# Altium schematic sheet ALIM.SchDoc
size A4
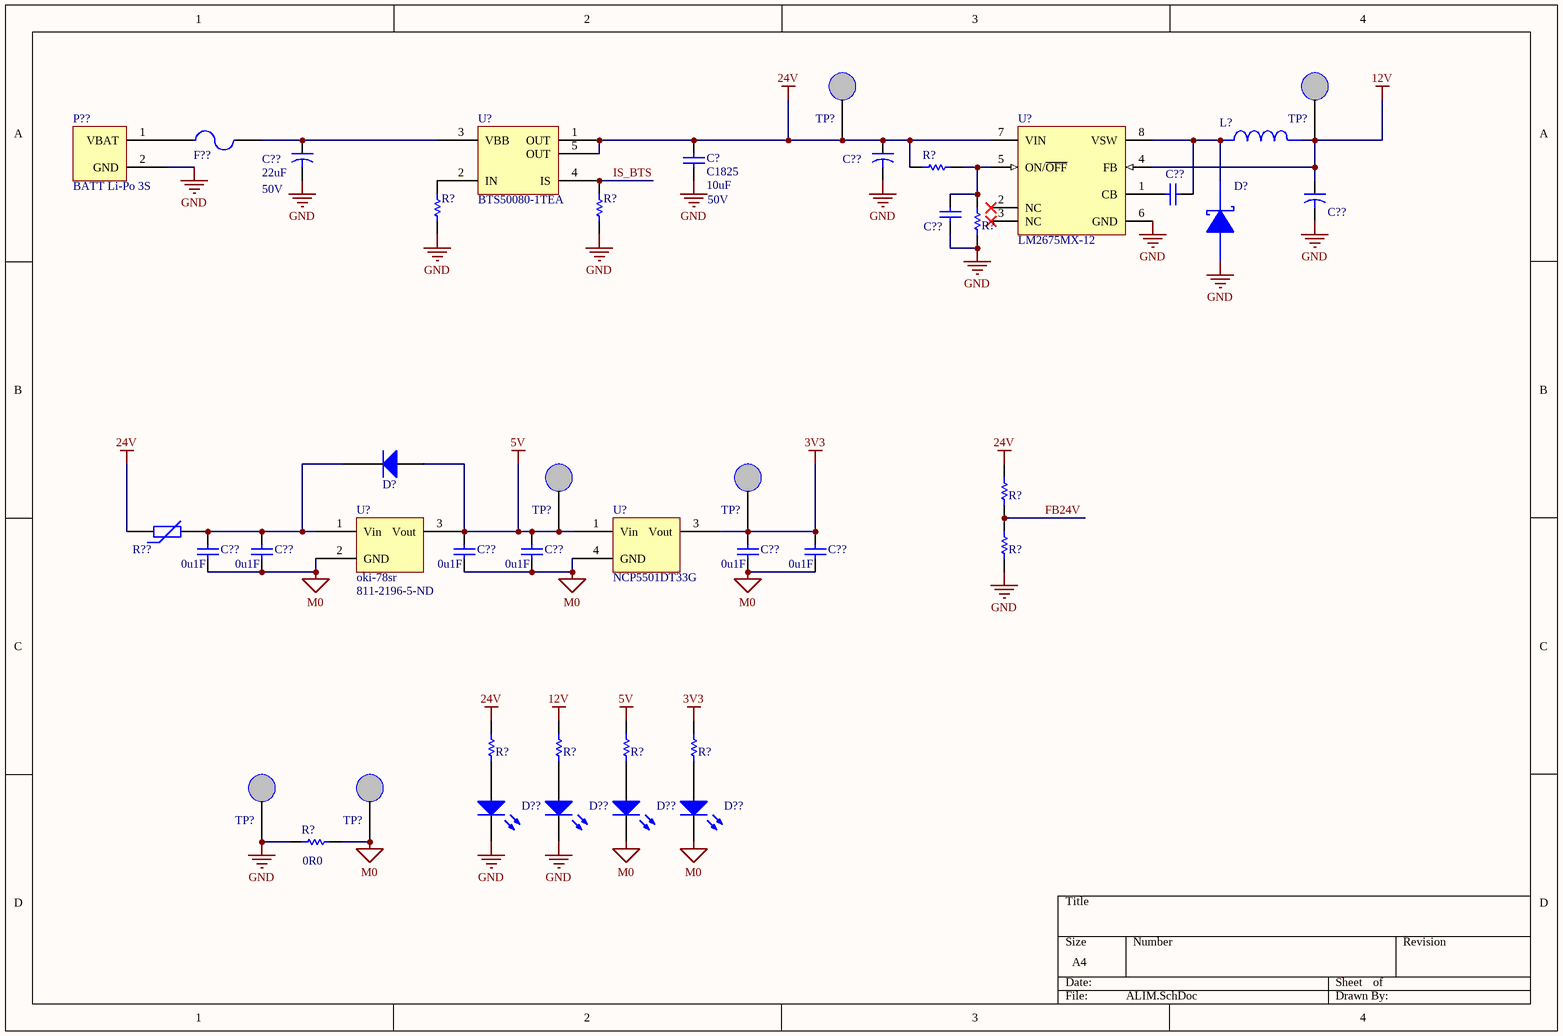
[diagram p0: ALIM.SchDoc]

## Parts
(Parts that share a designator on the sheet are numbered #1, #2 ... from top to bottom, then left to right.)
C?  C1825  value 10uF  Voltage: 50V  [1825]
C??#1  22uF  Voltage: 50V
C??#2  (no value)  [EKZE500ELL101MHB5D]
C??#3  1000uF  (value not drawn)
C??#4  C0805  [C0805]  (value not drawn)
C??#5  C0805  [C0805]  (value not drawn)
C??#6  value 0u1F  [C0805]  (hidden comment: C0805)
C??#7  value 0u1F  [C0805]  (hidden comment: C0805)
C??#8  value 0u1F  [C0805]  (hidden comment: C0805)
C??#9  value 0u1F  [C0805]  (hidden comment: C0805)
C??#10  value 0u1F  [C0805]  (hidden comment: C0805)
C??#11  value 0u1F  [C0805]  (hidden comment: C0805)
D?#1  CRS08  (value not drawn)
D?#2  Diode RETOUR  (value not drawn)
D??#1  HSMU-C220  [2.0X1.25X1.2]  (value not drawn)
D??#2  HSMU-C220  [2.0X1.25X1.2]  (value not drawn)
D??#3  HSMU-C220  [2.0X1.25X1.2]  (value not drawn)
D??#4  HSMU-C220  [2.0X1.25X1.2]  (value not drawn)
F??  Fuse BAT  [FUSE_1/4po_dX31.75mm]  (value not drawn)
L?  InductorBuck  (value not drawn)
P??  BATT Li-Po 3S  [XT60_CON]
R?#1  (no value)  [R0805]
R?#2  (no value)  [R0805]
R?#3  (no value)  [R0805]
R?#4  (no value)  [R0805]
R?#5  (no value)  [R0805]
R?#6  (no value)  [R0805]
R?#7  (no value)  [R0805]
R?#8  (no value)  [R0805]
R?#9  (no value)  [R0805]
R?#10  (no value)  [R0805]
R?#11  value 0R0  [8RB-1206]  (hidden comment: 1206)
R??  PTC  (value not drawn)
TP?#1  5003K  [5003K]  (value not drawn)
TP?#2  5003K  [5003K]  (value not drawn)
TP?#3  5003K  [5003K]  (value not drawn)
TP?#4  5003K  [5003K]  (value not drawn)
TP?#5  5003K  [5003K]  (value not drawn)
TP?#6  5003K  [5003K]  (value not drawn)
U?#1  LM2675MX-12  [M08A_N]
U?#2  BTS50080-1TEA
U?#3  oki-78sr  Supplier Part Number 1: 811-2196-5-ND  [oki-78sr]
U?#4  NCP5501DT33G  [DPAK-3]

## Nets
3V3: C??#10.2 C??#11.2 R?#10.2 TP?#4.1 U?#4.3(Vout)
5V: C??#8.2 C??#9.2 D?#2.1(A) R?#9.2 TP?#3.1 U?#3.3(Vout) U?#4.1(Vin)
12V: C??#3.1 L?.1 R?#8.2 TP?#2.1 U?#1.4(FB)
24V: C?.2 C??#2.1 R?#1.1 R?#5.2 R?#7.2 R??.1 TP?#1.1 U?#1.7(VIN) U?#2.1(OUT) U?#2.5(OUT)
GND: C?.1 C??#1.2 C??#2.2 C??#3.2 C??#5.1 D?#1.1(K) D??#1.2(K) D??#2.2(K) P??.2(GND) R?#2.1 R?#3.1 R?#4.1 R?#6.1 R?#11.2 TP?#5.1 U?#1.6(GND)
M0: C??#6.1 C??#7.1 C??#8.1 C??#9.1 C??#10.1 C??#11.1 D??#3.2(K) D??#4.2(K) R?#11.1 TP?#6.1 U?#3.2(GND) U?#4.4(GND)
FB24V: R?#5.1 R?#6.2
IS_BTS: R?#3.2 U?#2.4(IS)
NetC??#1_1: C??#1.1 F??.2 U?#2.3(VBB)
NetC??#4_1: C??#4.1 D?#1.2(A) L?.2 U?#1.8(VSW)
NetC??#4_2: C??#4.2 U?#1.1(CB)
NetC??#5_2: C??#5.2 R?#1.2 R?#4.2 U?#1.5(ON/~{OFF})
NetC??#6_2: C??#6.2 C??#7.2 D?#2.2(K) R??.2 U?#3.1(Vin)
NetD??#1_1: D??#1.1(A) R?#7.1
NetD??#2_1: D??#2.1(A) R?#8.1
NetD??#3_1: D??#3.1(A) R?#9.1
NetD??#4_1: D??#4.1(A) R?#10.1
NetF??_1: F??.1 P??.1(VBAT)
NetR?#2_2: R?#2.2 U?#2.2(IN)

Not connected (* = marked no-connect by the designer): U?#1 2(NC)* 3(NC)*

## Library data of the parts
C? = C1825: Ceramic Chip Capacitor - Standard; Published: 17-Jul-2002; LatestRevisionDate: 19-Mar-2004; LatestRevisionNote: Silkscreen size reduced.; DatasheetDocument: Mar-2001; PackageDocument: Mar-2001; PackageReference: 1825; Publisher: Altium Limited; Code_JEITA: 1825; Code_IPC: 4564 [1825]; ComponentLink1Description: Manufacturer Link; ComponentLink1URL: http://www.kemet.com/; ComponentLink2Description: Datasheet; ComponentLink2URL: http://www.kemet.com/kemet/web/homepage/kechome.nsf/vapubfilesname/F3102TA.pdf/$file/F3102TA.pdf
C??#1 = CAPINBAT
C??#2 = CAPINBUCK
C??#3 = CAPOUTBUCK
C??#4 C??#5 = C0805: Ceramic Chip Capacitor - Standard; Note: Footprint corresponds to dimensions for bulk cassette packaging. This case size has tightened tolerances.; Value: 100pF; Published: 17-Jul-2002; LatestRevisionDate: 19-Mar-2004; LatestRevisionNote: Silkscreen size reduced.; DatasheetDocument: Mar-2001; PackageDocument: Mar-2001; PackageReference: 0805; Publisher: Altium Limited; Code_JEITA: 0805; Code_IPC: 2012[0805]; ComponentLink1Description: Manufacturer Link; ComponentLink1URL: http://www.kemet.com/; ComponentLink2Description: Datasheet; ComponentLink2URL: http://www.kemet.com/kemet/web/homepage/kechome.nsf/vapubfilesname/F3102TA.pdf/$file/F3102TA.pdf
C??#6-C??#11 = C0805: Ceramic Chip Capacitor - Standard; Note: Footprint corresponds to dimensions for bulk cassette packaging. This case size has tightened tolerances.; Published: 17-Jul-2002; LatestRevisionDate: 19-Mar-2004; LatestRevisionNote: Silkscreen size reduced.; DatasheetDocument: Mar-2001; PackageDocument: Mar-2001; PackageReference: 0805; Publisher: Altium Limited; Code_JEITA: 0805; Code_IPC: 2012[0805]; ComponentLink1Description: Manufacturer Link; ComponentLink1URL: http://www.kemet.com/; ComponentLink2Description: Datasheet; ComponentLink2URL: http://www.kemet.com/kemet/web/homepage/kechome.nsf/vapubfilesname/F3102TA.pdf/$file/F3102TA.pdf
D?#1 = Schkotty Buck
D??#1-D??#4 = HSMU-C220: High Performance Chip LED, Amber; LuminousIntensity: 100mcd (Minimum).; PCB_Layout: Complies with manufacturer's recommendation.; Published: 11-Dec-2002; DatasheetVersion: 30-Apr-2002; PackageVersion: Apr-2002; PackageReference: 2.0X1.25X1.2; Publisher: Altium Limited; PackageDescription: SM LED; 2 Flat Leads; LED_Colour: Amber; ComponentLink1Description: Manufacturer Link; ComponentLink1URL: http://www.avagotech.com/; ComponentLink2Description: Datasheet; ComponentLink2URL: http://cp.literature.agilent.com/litweb/pdf/5988-6549EN.pdf
F?? = Fuse BAT: Fuse BATT; LatestRevisionNote: Re-released for DXP Platform.; Publisher: Altium Limited
P?? = XT60: BATT Li-Po 22.2V
R?#1-R?#10 = R0805: Resistor 0805
R?#11 = ERJ8RS: Low Ohmic Value Thick Film Chip Resistor, 0.1 Ohm to 0.2 Ohm Range, 1%, 2% and 5% Tolerance, 1206 Size, 0.25 W; Published: 17-Dec-2003; LatestRevisionDate: 19-Mar-2004; LatestRevisionNote: Silkscreen size reduced.; PackageDocument: Mar-2003; PackageReference: 8RB-1206; Publisher: Altium Limited; Code_IPC: 3216 [1206]; ComponentLink1Description: Manufacturer Link; ComponentLink1URL: http://www.panasonic.com/industrial/components/resistive_products.htm; ComponentLink2Description: Datasheet; ComponentLink2URL: http://www.panasonic.com/industrial/components/pdf/AOA0000CE3.pdf
TP?#1-TP?#6 = Testpoint: Testpoint for power
U?#1 = LM2675MX-12: SIMPLE SWITCHER® Power Converter High Efficiency 1A Step-Down Voltage Regulator, 8-pin Narrow SOIC; Manufacturer: National Semiconductor; PackageTopMarking: NSZXTT*2675*M-12; PowerWise: N; Published: 1-Mar-2010; DatasheetVersion: Jun-2005; PackageVersion: revM, May-2009; PackageReference: M08A; Publisher: Altium Limited; PackageDescription: SOIC Narrow, 4.9 x 3.9 x 1.45mm, 8 Lead, 1.27mm Pitch; PartNumber: LM2675MX-12; RoHS: N; PinCount: 8; CompType: Switcher; Code_JEDEC: MS-012-AA; Code_IPC: SOIC127P600-8; ComponentLink1Description: LM2675 Datasheet; ComponentLink1URL: http://www.national.com/ds/LM/LM2675.pdf; ComponentLink2Description: LM2675 Web Page; ComponentLink2URL: http://www.national.com/pf/LM/LM2675.html; ComponentLink3Description: M08A Package Page; ComponentLink3URL: http://www.national.com/packaging/folders/m08a.html
U?#3 = oki-78sr: 5V 1.5A (Vin 7V-36V) swiching power supply - board mount; Supplier 1: Digi-Key
U?#4 = NCP5501DT33G: LDO 3.3V current limited 500 mA